# EAGLE design LipSync_Switch_Board (EAGLE 9.5.0)
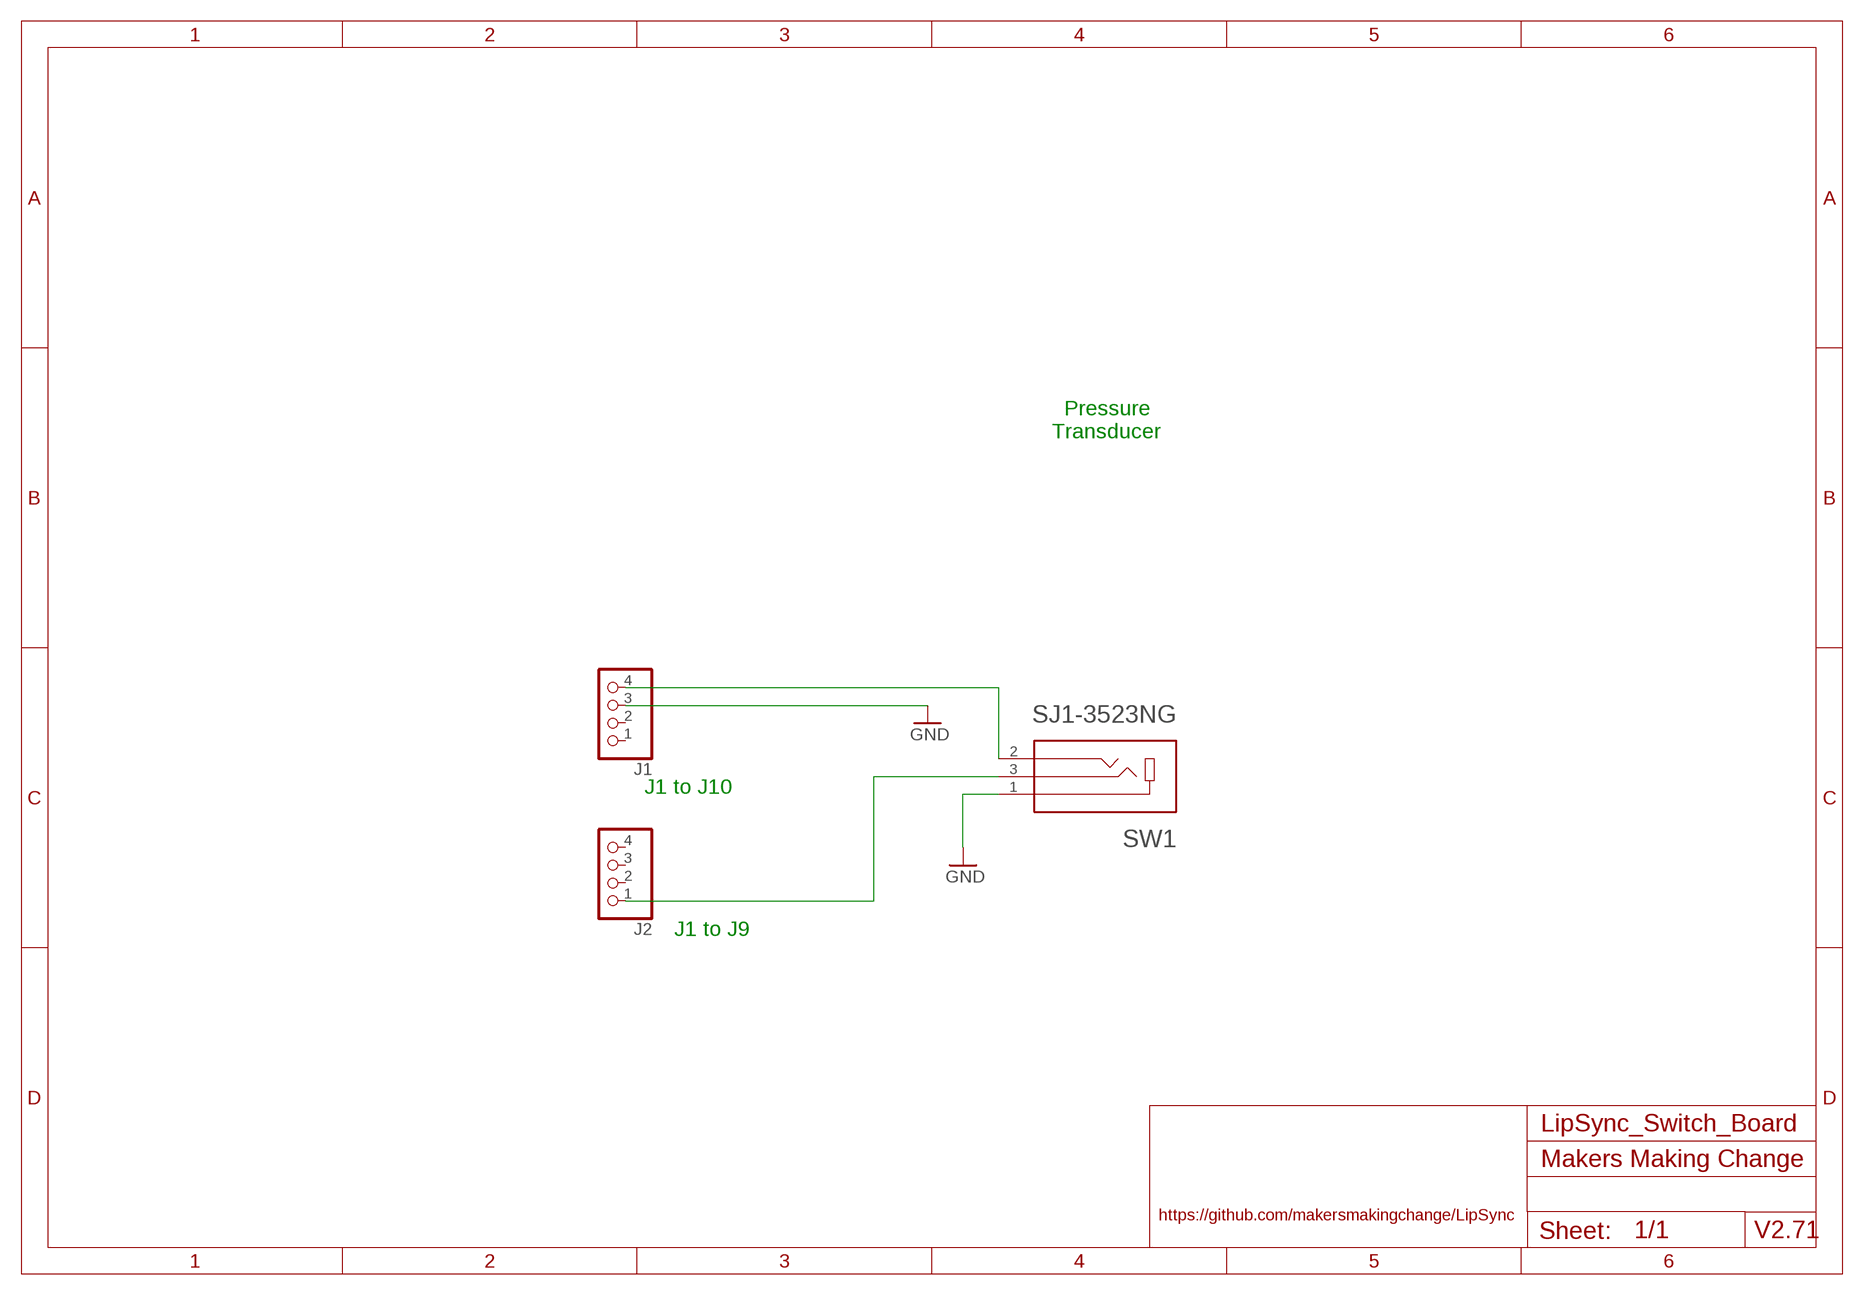
[diagram p0: schematic, sheet 1]

## Parts
J1  PINHEAD_PINHD-1X4  [PINHEAD_1X04]
J2  PINHEAD_PINHD-1X4  [PINHEAD_1X04]
SW1  SJ1-3523NG  [CUI_SJ1-3523NG]

## Nets
GND: J1.3 SW1.1
N$1: J1.4 SW1.2
N$2: J2.1 SW1.3
Unconnected: J1.1 J1.2 J2.2 J2.3 J2.4

## Notes on the sheet
- Pressure
  Transducer
- J1 to J10
- J1 to J9
- Makers Making Change
- https://github.com/makersmakingchange/LipSync
- V2.71

## Library data of the parts
J1 J2 = MMC Eagle:PINHEAD_PINHD-1X4: PIN HEADER
SW1 = MMC Eagle:SJ1-3523NG: 3.5 mm Right-Angle Stereo Jack, 3 Pin PCB Mount, Isolated Ground; MANUFACTURER: CUI; PARTREV: 1.01; STANDARD: Manufacturer recommendation

## Net classes
0 GND: clearance 0.205 mm
2 GND2: clearance 0.205 mm to class 0, clearance 0.205 mm to class 1, clearance 0.205 mm
3 GND3: clearance 0.205 mm to class 0, clearance 0.205 mm to class 1, clearance 0.205 mm to class 2, clearance 0.205 mm

## Board
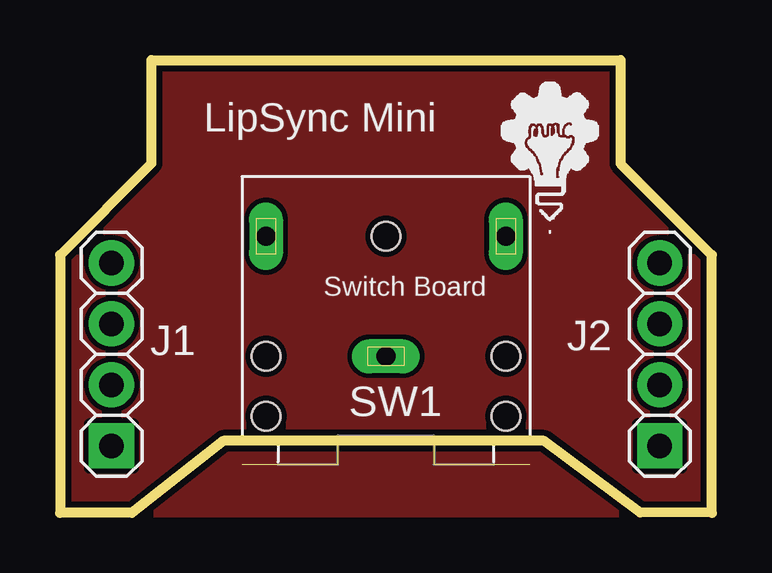
[diagram p1: board, top side]
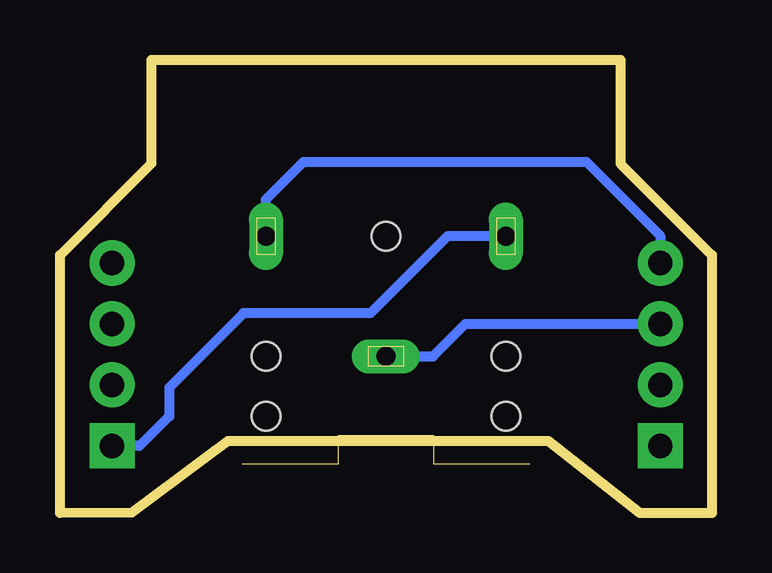
[diagram p2: board, bottom side, seen from below]

Size 27.18 x 18.87 mm. Coordinates in mm from the lower left corner, seen from the top.
Outline: 27.18,0 24.18,0.03 20.18,3 6.82,3 3,0 0,0 0,10.75 3.81,14.56 3.81,18.87 23.37,18.87 23.37,14.56 27.18,10.75 27.18,0
Copper layers (1*16): Top 0.035mm / dielectric 1.5mm / Bottom 0.035mm
Design rules "SparkFun": minimum track width 8mil, minimum drill 20mil, track to track 8mil, track to pad 8mil, pad to pad 8mil, via to via 8mil, smd to smd 8mil, copper to edge 10mil, drill to drill 8mil, minimum pad ring 12mil, minimum via ring 10mil, stop-mask expansion 4mil, vias tented up to drill 25mil, thermal gap 10mil

### Footprints (pad centres in the part's own frame; a part is rotated, then mirrored left to right if it is on the bottom)
PINHEAD_1X04 = drill 1.016 pad 1.88 square: 1 -3.81,0 | drill 1.016 pad 1.88: 2 -1.27,0; 3 1.27,0; 4 3.81,0
CUI_SJ1-3523NG = drill 0.8 long: 1 0,0; 2 5,-5; 3 5,5 | hole 1.2: -2.5,5; 0,5; 5,0; -2.5,-5; 0,-5

### Placement (x,y rotation side)
J1  2.15,6.61 90 top
J2  25.01,6.61 90 top
SW1  13.59,6.53 90 top

### Tracks (layer width: path | path; a pad name or v marks a point on that pad's centre or on a via)
GND
  Bottom 0.406: SW1.1 11.63,6.53 10.28,7.88 J1.3
GND2
  pour Top: 0,0 0,10.75 3.81,14.56 3.81,18.87 23.37,18.87 23.37,14.56 27.18,10.75 27.18,0
N$1
  Bottom 0.406: SW1.2 18.59,13.06 17.03,14.63 5.23,14.63 2.15,11.55 J1.4
N$2
  Bottom 0.406: SW1.3 11.03,11.53 14.23,8.33 19.53,8.33 22.63,5.23 22.63,4.03 23.86,2.8 J2.1

### Text on the board
tNames: LipSync Mini | Switch Board | J1 | J2